# Altium schematic sheet MCU main.SchDoc: MCU
size A3; Date: 30 08 2013; Author: Rachid AKKOUCHE; CompanyName: RASoftware; DrawnBy: Rachid AKKOUCHE; Organization: RASoftware; Address1: 52 J03, rue de la crèche; Address2: 77100 MEAUX; Address3: FRANCE; DocumentNumber: BRA201308302C; Revision: C; SheetNumber: 2; SheetTotal: 11; Telephone: +33651604047; Email: rachid.akkouche@wanadoo.fr; Proprietaire: MDI System; Dessinepar: -; Verifiepar: -; Time: 19:00
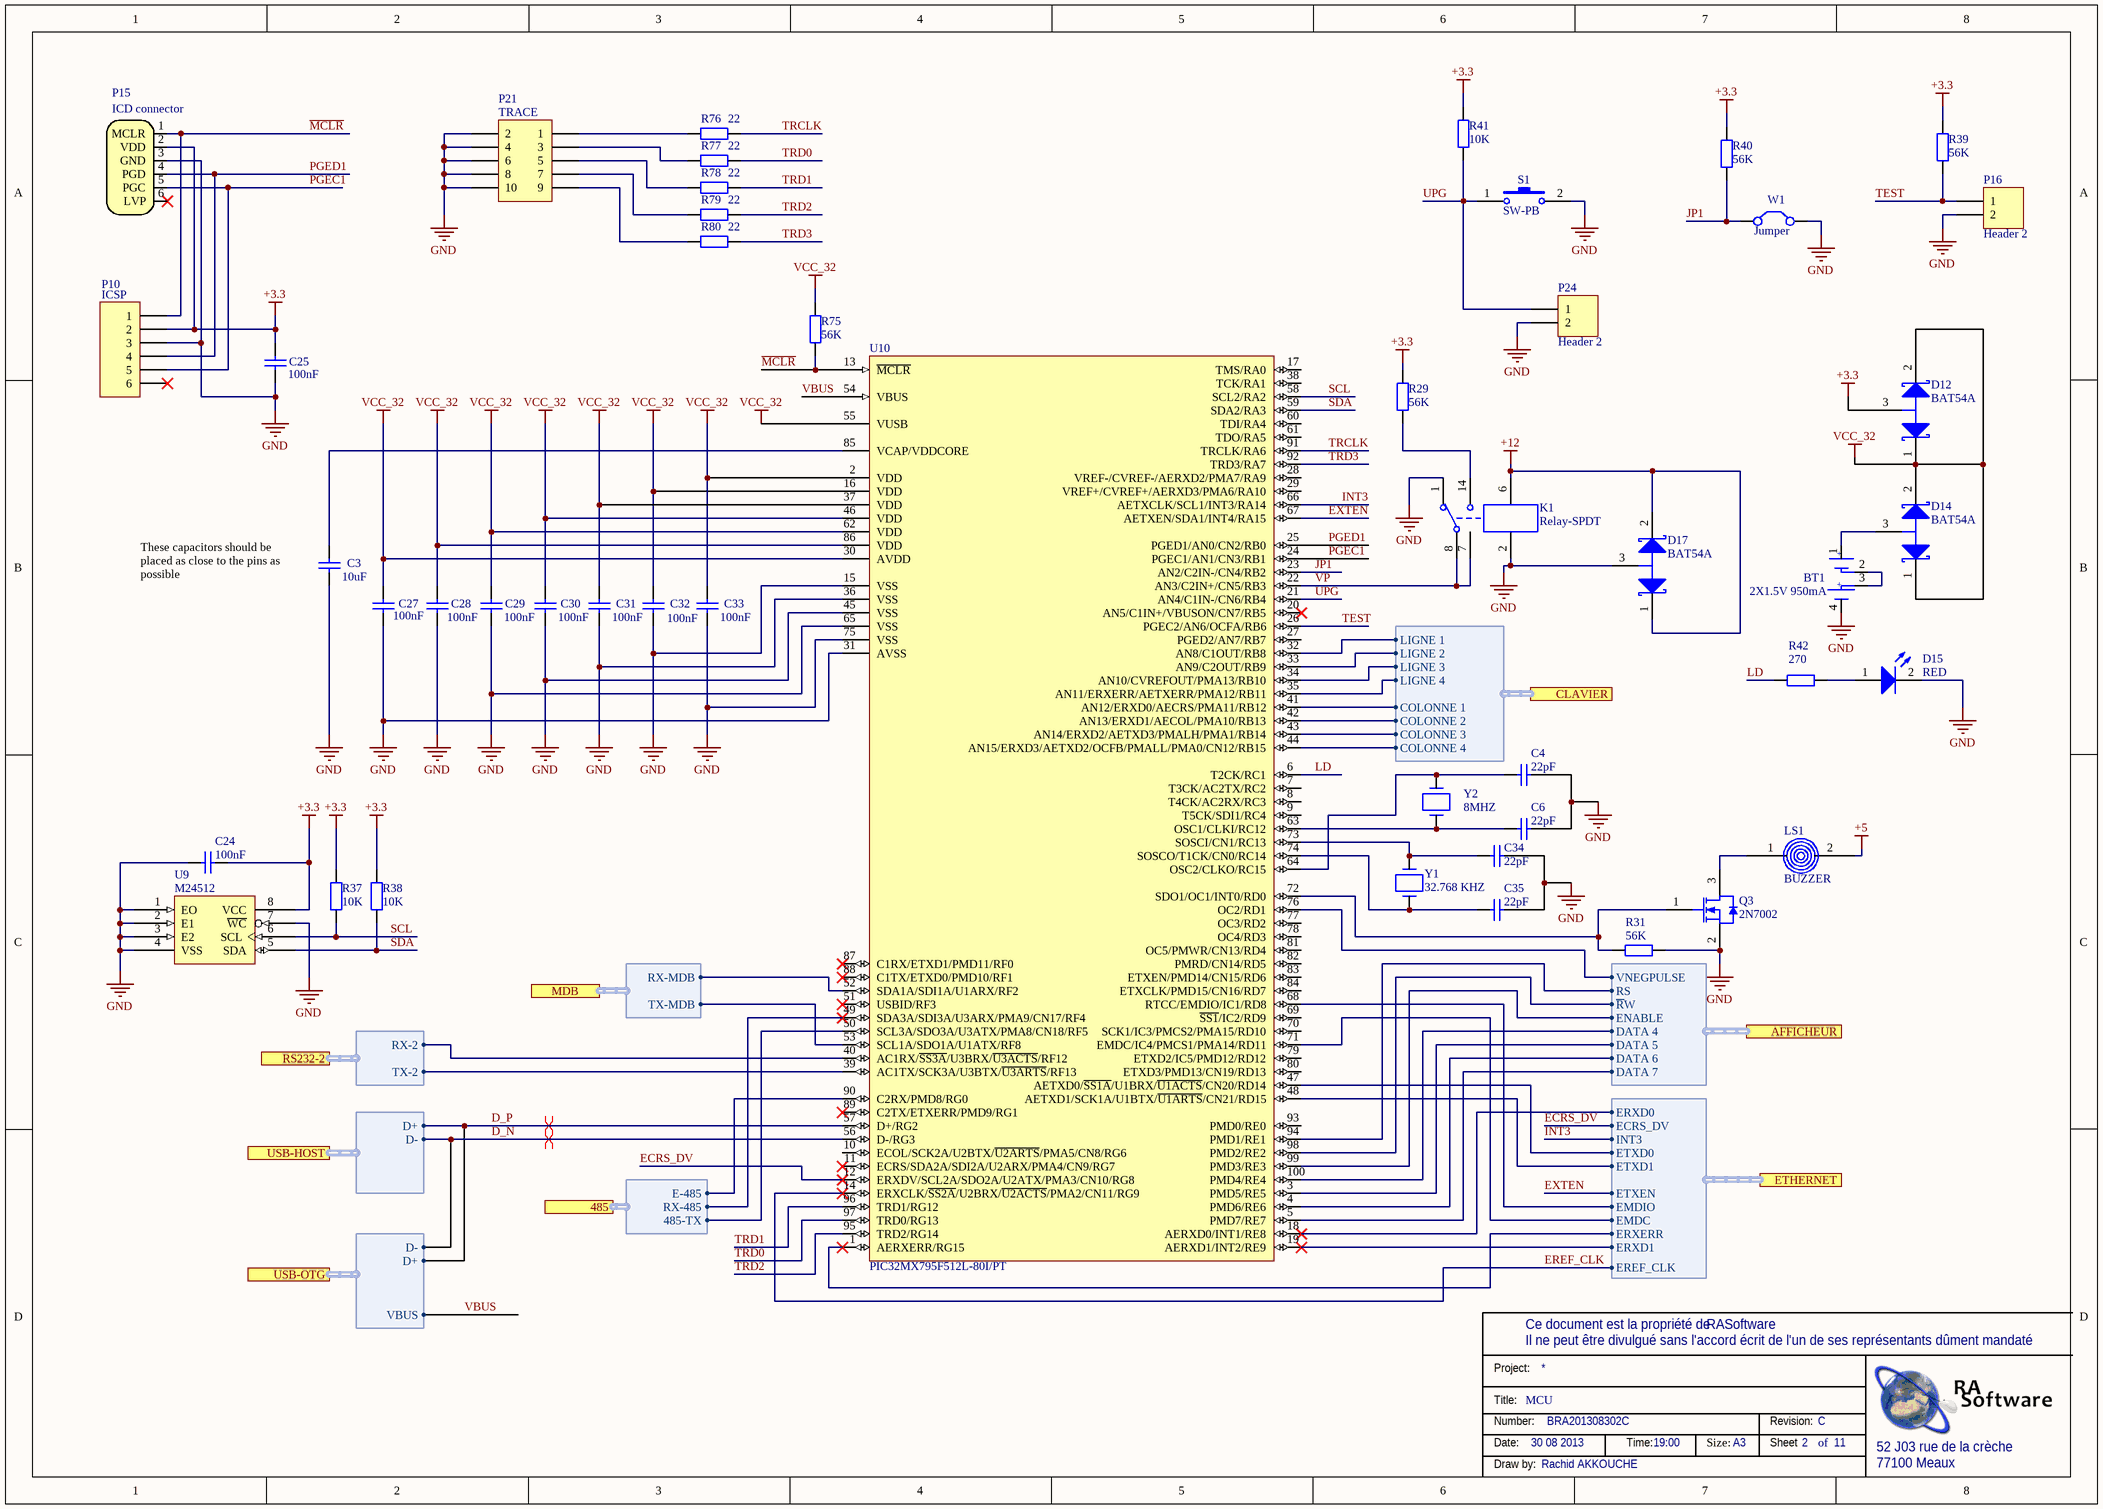
[diagram p0: MCU main.SchDoc]

## Parts
BT1  2X1.5V 950mA  [Support Pile 1023]
C3  10uF  [c0805]
C4  22pF  [C0805]
C6  22pF  [C0805]
C24  100nF  [C0805]
C25  100nF  [C0805]
C27  100nF  [C0805]
C28  100nF  [C0805]
C29  100nF  [C0805]
C30  100nF  [C0805]
C31  100nF  [C0805]
C32  100nF  [C0805]
C33  100nF  [C0805]
C34  22pF  [C0805]
C35  22pF  [C0805]
D12  BAT54A  [SOT23]
D14  BAT54A  [SOT23]
D15  Couleur: RED  [0603-LEDR]  (hidden comment: HSMH-C190)
D17  BAT54A  [SOT23]
K1  Relay-SPDT  [RELE-REED-PVX6012]
LS1  BUZZER
P10  M20-8770642  [M20_1X6]  (value not drawn)  (no BOM)
P15  ICD connector  [TC2030]  (no BOM)
P16  Header 2  [M20_1X2]
P21  M20-8760542  [HE10_10PTS_CMS]  (value not drawn)  (no BOM)
P24  Header 2  [M20_1X2]
Q3  2N7002  [SOT23]
R29  56K  [R0805]
R31  56K  [R0805]
R37  10K  [R0805]
R38  10K  [R0805]
R39  56K  [R0805]
R40  56K  [R0805]
R41  10K  [R0805]
R42  270  [R0805]
R75  56K  [R0805]
R76  22  [R0805]  (no BOM)
R77  22  [R0805]  (no BOM)
R78  22  [R0805]  (no BOM)
R79  22  [R0805]  (no BOM)
R80  22  [R0805]  (no BOM)
S1  SW-PB  [EVQQ2Y03W]
U9  M24512  [SOIC8]
U10  PIC32MX795F512L-80I/PT  [TQFP100pt]
W1  Jumper  [M20_1X2]
Y1  32.768 KHZ  [FSRLF]
Y2  8MHZ  [86SMX]

## Ports
485 (harness EIA-485), AFFICHEUR (harness IO DISPLAY), CLAVIER (harness KEYBOARD), ETHERNET (harness ETHERNET), MDB (harness MDB), RS232-2 (harness RS232_2), USB-HOST (harness USB-HOST), USB-OTG (harness USG-OTG)

## Harnesses
USB-HOST: D-, D+
USG-OTG: D-, D+, VBUS
RS232_2: TX-2, RX-2
ETHERNET: ETXEN, ETXD0, ETXD1, INT3, EMDIO, EMDC, ECRS_DV, ERXERR, ERXD0, ERXD1, EREF_CLK
IO DISPLAY: DATA 4, DATA 5, DATA 6, DATA 7, ENABLE, ~{R}W, RS, VNEGPULSE
KEYBOARD: COLONNE 1, COLONNE 2, COLONNE 3, COLONNE 4, LIGNE 1, LIGNE 2, LIGNE 3, LIGNE 4
EIA-485: 485-TX, RX-485, E-485
MDB: TX-MDB, RX-MDB

## Nets
+3.3: C24.1 C25.2 D12.3(A) P10.2 P15.2(VDD) R29.2 R37.2 R38.2 R39.2 R40.2 R41.2 U9.8(VCC)
+5: LS1.2(GND)
+12: D17.1(K1) D17.2(K2) K1.6
GND: BT1.4 C3.2 C4.1 C6.1 C24.2 C25.1 C27.1 C28.1 C29.1 C30.1 C31.1 C32.1 C33.1 C34.1 C35.1 D15.2(K) D17.3(A) K1.1 K1.2 P10.3 P15.3(GND) P16.2 P21.2 P21.4 P21.6 P21.8 P21.10 P24.2 Q3.2(S) R31.1 S1.2 U9.1(EO) U9.2(E1) U9.3(E2) U9.4(VSS) U9.7(~{WC}) U10.15(VSS) U10.31(AVSS) U10.36(VSS) U10.45(VSS) U10.65(VSS) U10.75(VSS) W1.2(C2)
VCC_32: C27.2 C28.2 C29.2 C30.2 C31.2 C32.2 C33.2 D12.1(K1) D12.2(K2) D14.1(K1) D14.2(K2) R75.2 U10.2(VDD) U10.16(VDD) U10.30(AVDD) U10.37(VDD) U10.46(VDD) U10.55(VUSB) U10.62(VDD) U10.86(VDD)
D_N: U10.56(D-/RG3) ; port USB-HOST.D-, port USB-OTG.D-
D_P: U10.57(D+/RG2) ; port USB-HOST.D+, port USB-OTG.D+
ECRS_DV: U10.12(ERXDV/SCL2A/SDO2A/U2ATX/PMA3/CN10/RG8) ; port ETHERNET.ECRS_DV
EREF_CLK: U10.14(ERXCLK/~{SS2A}/U2BRX/~{U2ACTS}/PMA2/CN11/RG9) ; port ETHERNET.EREF_CLK
EXTEN: U10.67(AETXEN/SDA1/INT4/RA15) ; port ETHERNET.ETXEN
INT3: U10.66(AETXCLK/SCL1/INT3/RA14) ; port ETHERNET.INT3
JP1: R40.1 U10.23(AN2/C2IN-/CN4/RB2) W1.1(C1)
LD: R42.2 U10.6(T2CK/RC1)
~{MCLR}: P10.1 P15.1(MCLR) R75.1 U10.13(~{MCLR})
PGEC1: P10.5 P15.5(PGC) U10.24(PGEC1/AN1/CN3/RB1)
PGED1: P10.4 P15.4(PGD) U10.25(PGED1/AN0/CN2/RB0)
SCL: R37.1 U9.6(SCL) U10.58(SCL2/RA2)
SDA: R38.1 U9.5(SDA) U10.59(SDA2/RA3)
TEST: P16.1 R39.1 U10.26(PGEC2/AN6/OCFA/RB6)
TRCLK: R76.1 U10.91(TRCLK/RA6)
TRD0: R77.1 U10.97(TRD0/RG13)
TRD1: R78.1 U10.96(TRD1/RG12)
TRD2: R79.1 U10.95(TRD2/RG14)
TRD3: R80.1 U10.92(TRD3/RA7)
UPG: P24.1 R41.1 S1.1 U10.21(AN4/C1IN-/CN6/RB4)
VBUS: U10.54(VBUS) ; port USB-OTG.VBUS
VP: K1.7 K1.8 U10.22(AN3/C2IN+/CN5/RB3)
NetBT1_1: BT1.1(+) D14.3(A)
NetBT1_2: BT1.2 BT1.3
NetC3_1: C3.1 U10.85(VCAP/VDDCORE)
NetC4_2: C4.2 U10.64(OSC2/CLKO/RC15) Y2.2
NetC6_2: C6.2 U10.63(OSC1/CLKI/RC12) Y2.1
NetC34_2: C34.2 U10.73(SOSCI/CN1/RC13) Y1.1
NetC35_2: C35.2 U10.74(SOSCO/T1CK/CN0/RC14) Y1.2
NetD15_1: D15.1(A) R42.1
NetK1_14: K1.14 R29.1
NetLS1_1: LS1.1(+) Q3.3(D)
NetP21_1: P21.1 R76.2
NetP21_3: P21.3 R77.2
NetP21_5: P21.5 R78.2
NetP21_7: P21.7 R79.2
NetP21_9: P21.9 R80.2
NetQ3_1: Q3.1(G) R31.2 U10.72(SDO1/OC1/INT0/RD0)
NetU10_1: U10.1(AERXERR/RG15) ; port ETHERNET.ERXERR
NetU10_3: U10.3(PMD5/RE5) ; port AFFICHEUR.DATA 5
NetU10_4: U10.4(PMD6/RE6) ; port AFFICHEUR.DATA 6
NetU10_5: U10.5(PMD7/RE7) ; port AFFICHEUR.DATA 7
NetU10_18: U10.18(AERXD0/INT1/RE8) ; port ETHERNET.ERXD0
NetU10_19: U10.19(AERXD1/INT2/RE9) ; port ETHERNET.ERXD1
NetU10_32: U10.32(AN8/C1OUT/RB8) ; port CLAVIER.LIGNE 1
NetU10_33: U10.33(AN9/C2OUT/RB9) ; port CLAVIER.LIGNE 2
NetU10_34: U10.34(AN10/CVREFOUT/PMA13/RB10) ; port CLAVIER.LIGNE 3
NetU10_35: U10.35(AN11/ERXERR/AETXERR/PMA12/RB11) ; port CLAVIER.LIGNE 4
NetU10_39: U10.39(AC1TX/SCK3A/U3BTX/~{U3ARTS}/RF13) ; port RS232-2.TX-2
NetU10_40: U10.40(AC1RX/~{SS3A}/U3BRX/~{U3ACTS}/RF12) ; port RS232-2.RX-2
NetU10_41: U10.41(AN12/ERXD0/AECRS/PMA11/RB12) ; port CLAVIER.COLONNE 1
NetU10_42: U10.42(AN13/ERXD1/AECOL/PMA10/RB13) ; port CLAVIER.COLONNE 2
NetU10_43: U10.43(AN14/ERXD2/AETXD3/PMALH/PMA1/RB14) ; port CLAVIER.COLONNE 3
NetU10_44: U10.44(AN15/ERXD3/AETXD2/OCFB/PMALL/PMA0/CN12/RB15) ; port CLAVIER.COLONNE 4
NetU10_47: U10.47(AETXD0/~{SS1A}/U1BRX/~{U1ACTS}/CN20/RD14) ; port ETHERNET.ETXD0
NetU10_48: U10.48(AETXD1/SCK1A/U1BTX/~{U1ARTS}/CN21/RD15) ; port ETHERNET.ETXD1
NetU10_49: U10.49(SDA3A/SDI3A/U3ARX/PMA9/CN17/RF4) ; port 485.RX-485
NetU10_50: U10.50(SCL3A/SDO3A/U3ATX/PMA8/CN18/RF5) ; port 485.485-TX
NetU10_52: U10.52(SDA1A/SDI1A/U1ARX/RF2) ; port MDB.RX-MDB
NetU10_53: U10.53(SCL1A/SDO1A/U1ATX/RF8) ; port MDB.TX-MDB
NetU10_68: U10.68(RTCC/EMDIO/IC1/RD8) ; port ETHERNET.EMDIO
NetU10_71: U10.71(EMDC/IC4/PMCS1/PMA14/RD11) ; port ETHERNET.EMDC
NetU10_76: U10.76(OC2/RD1) ; port AFFICHEUR.VNEGPULSE
NetU10_90: U10.90(C2RX/PMD8/RG0) ; port 485.E-485
NetU10_94: U10.94(PMD1/RE1) ; port AFFICHEUR.RS
NetU10_98: U10.98(PMD2/RE2) ; port AFFICHEUR.~{R}W
NetU10_99: U10.99(PMD3/RE3) ; port AFFICHEUR.ENABLE
NetU10_100: U10.100(PMD4/RE4) ; port AFFICHEUR.DATA 4

Not connected (* = marked no-connect by the designer): P10 6*; P15 6(LVP)*; U10 7(T3CK/AC2TX/RC2) 8(T4CK/AC2RX/RC3) 9(T5CK/SDI1/RC4) 10(ECOL/SCK2A/U2BTX/~{U2ARTS}/PMA5/CN8/RG6) 11(ECRS/SDA2A/SDI2A/U2ARX/PMA4/CN9/RG7)* 17(TMS/RA0) 20(AN5/C1IN+/VBUSON/CN7/RB5)* 27(PGED2/AN7/RB7) 28(VREF-/CVREF-/AERXD2/PMA7/RA9) 29(VREF+/CVREF+/AERXD3/PMA6/RA10) 38(TCK/RA1) 51(USBID/RF3)* 60(TDI/RA4) 61(TDO/RA5) 69(~{SS1}/IC2/RD9) 70(SCK1/IC3/PMCS2/PMA15/RD10) 77(OC3/RD2) 78(OC4/RD3) 79(ETXD2/IC5/PMD12/RD12) 80(ETXD3/PMD13/CN19/RD13) 81(OC5/PMWR/CN13/RD4) 82(PMRD/CN14/RD5) 83(ETXEN/PMD14/CN15/RD6) 84(ETXCLK/PMD15/CN16/RD7) 87(C1RX/ETXD1/PMD11/RF0)* 88(C1TX/ETXD0/PMD10/RF1)* 89(C2TX/ETXERR/PMD9/RG1)* 93(PMD0/RE0)

## Layout directives
differential pair: D_N, D_P

## Notes on the sheet
- (near C3) These capacitors should be placed as close to the pins as possible
- Ce document est la propriété de
- Project:
- Il ne peut être divulgué sans l'accord écrit de l'un de ses représentants dûment mandaté
- Title:
- Number:
- Date:
- Time:
- Size:
- A3
- Revision:
- Sheet
- of
- 52 J03 rue de la crèche
- Draw by:
- 77100 Meaux
- (in symbol Header 5X2) TRACE
- (in symbol Header 6) ICSP

## Library data of the parts
BT1 = BATTERYX2
C3 = Cap 0805 1uF: Capacitor; Manufacturer: YAGEO; Manufacturer Part Number: CC0805KKX5R5BB106; Unit: pcs; SuppliedAmount: 3000; MinAmount: 100; Capacitor type: ceramic; Capacitor kind: MLCC; Capacitance: 10µF; Operating voltage: 6.3V; Dielectric: X5R; Tolerance: ±10%; Supplier 1: TME; Supplier Part Number 1: CC0805KKX5R5106; Category: 0805 MLCC SMD Capacitors; Stock 1: 19000; Weight: 0,034; Multiples: 100; Mounting: SMD; Case: 0805; ComponentLink1URL: http://www.tme.eu/en/details/cc0805kkx5r5106/0805-mlcc-smd-capacitors/yageo/cc0805kkx5r5bb106/; ComponentLink1Description: http://www.tme.eu/en/details/cc0805kkx5r5106/0805-mlcc-smd-capacitors/yageo/cc0805kkx5r5bb106/
C4 C6 C34 C35 = Cap 0805 22pF: Capacitor; Manufacturer: YAGEO; Manufacturer Part Number: CC0805JRNPO9BN220; Supplier 1: Farnell; Supplier Part Number 1: 1816807; RoHS: YES; Pricing 1: 1=0,019, 25=0,016, 50=0,014, 100=0,011, 200=0,009, 1000=0,008 (EUR); ComponentLink1URL: http://www.farnell.com/datasheets/1132289.pdf; ComponentLink1Description: http://www.farnell.com/datasheets/1132289.pdf; Stock 1: 154
C24 C25 C27-C33 = Cap 0805 100nF: Capacitor; Manufacturer: MULTICOMP; Manufacturer Part Number: MCCA000296; Supplier 1: Farnell; Supplier Part Number 1: 1759167; Pricing 1: 100=0,01, 500=0,008, 1000=0,006, 4000=0,005 (EUR); ComponentLink1URL: http://www.farnell.com/datasheets/1520827.pdf; ComponentLink1Description: http://www.farnell.com/datasheets/1520827.pdf
D12 D14 D17 = BAT54A: Schottky Barrier Double Diode; Manufacturer: FAIRCHILD SEMICONDUCTOR; Courant, If moy.: 200; Tension, Vrrm: 30; Tension, Vf max..: 320; Temps trr max.: 5; Courant, Ifs max.: 600; Température d'utilisation min: -55; Température de fonctionnement max..: 150; Type de boîtier diode: SOT-23; Nombre de broches: 3; SVHC: No SVHC (20-Jun-2013); Configuration diode: Double anode commune; Courant, If, Vf: 1; Marquage, CMS: L42; Température de fonctionnement: -55°C à +150; Type de terminaison: SMD; Supplier 1: Farnell; Supplier Part Number 1: 1228222; Manufacturer Part Number: BAT54A; RoHS: YES; Pricing 1: 5=0,084, 25=0,082, 100=0,036, 1000=0,032, 3000=0,03 (EUR); Diode Type: Schottky; MSL: MSL 1 - Illimité; Température, Tj max..: 150; Type de boîtier: SOT-23; courant Ifsm: 600; ComponentLink1URL: http://www.farnell.com/datasheets/1718084.pdf; ComponentLink1Description: http://www.farnell.com/datasheets/1718084.pdf; ComponentLink2URL: http://www.farnell.com/datasheets/410597.pdf; ComponentLink2Description: http://www.farnell.com/datasheets/410597.pdf
D15 = HSMH-C190: Surface Mount Chip LED, Red; Manufacturer: AVAGO TECHNOLOGIES; Manufacturer Part Number: HSMH-C190.; Taille de lampe: 0.8mm x 1; Couleur de LED: Rouge; Intensité lumineuse: 17; Angle, vision: 170°; Courant, direct, If: 20; Tension, direct à  If: 1.8; Montage LED: CMS; Forme de lentille: Rectangulaire; Longueur d'onde typ.: 626; SVHC: No SVHC (19-Dec-2012); Dissipation de puissance: 65; Intensité lumineuse min. à  If: 2.8; Intensité lumineuse typique: 10; Largeur (externe): 0.8; Longueur d'onde dominante: 639; Longueur d'onde, crête: 630; Longueur/hauteur: 1.6; Matière: AlGaAs; Nombre de broches: 2; Orientation de montage opto: Dessus; Orientation sortie de lumière: Top Emitting; Température de fonctionnement: -30°C à +85; Température de fonctionnement max..: 85; Température, stockage min.: -40; Température d'utilisation min: -30; Tension, Vf max..: 2.6; Tension, Vf min.: 2.1; Type de LED: Standard; Supplier 1: Farnell; Supplier Part Number 1: 8554641; RoHS: YES; Stock 1: 13902; Pricing 1: 5=0,06, 25=0,059, 100=0,057, 250=0,052, 500=0,047 (EUR); MSL: MSL 2A - 4 semaines; Couleur, LED: Rouge; Profondeur: 0.8; Température, stockage max..: 85; Tension, Vf typ.: 1.8; ComponentLink1URL: http://www.farnell.com/datasheets/313031.pdf; ComponentLink1Description: http://www.farnell.com/datasheets/313031.pdf; ComponentLink2URL: http://www.farnell.com/datasheets/55927.pdf; ComponentLink2Description: http://www.farnell.com/datasheets/55927.pdf
K1 = Relay-SPDT: Single-Pole Dual-Throw Relay; Manufacturer: STANDEXMEDER; Manufacturer Part Number: DIP12-1C90-51L; Published: 24-Mar-1999; LatestRevisionDate: 17-Jul-2002; LatestRevisionNote: Re-released for DXP Platform.; PackageReference: MODULE5B; Publisher: Altium Limited; Supplier 1: Farnell; Supplier Part Number 1: 1079450; RoHS: YES; Stock 1: 98; Pricing 1: 1=7,78, 10=6,03, 25=5,83, 50=5,7, 90=5,12, 300=4,53, 900=4,07, 2000=3,67 (EUR); ComponentLink1URL: http://www.farnell.com/datasheets/91165.pdf; ComponentLink1Description: http://www.farnell.com/datasheets/91165.pdf
LS1 = ABI-017-RC: SMD magnetic transducter buzzer; Manufacturer: Pro Signal; Self Resonant Frequency: 2.4kHz; Min Supply Voltage (DC): 4V; Max Supply Voltage (DC): 7V; Supplier 1: Farnell; Manufacturer Part Number: ABI-017-RC; Stock 1: 13787; Pricing 1: 1=2.5, 10=2.21, 50=2.18, 100=2.16, 200=2.12, 500=2.07, 2500=2.03 (EUR); Case/Package: SMD/SMT; Height: 12.8mm; REACH SVHC: No SVHC; ComponentLink1URL: https://datasheet.ciiva.com/1323/1671249-1323219.pdf; ComponentLink1Description: https://datasheet.ciiva.com/1323/1671249-1323219.pdf; ComponentLink2URL: https://datasheet.ciiva.com/1743/97464-1743575.pdf; ComponentLink2Description: https://datasheet.ciiva.com/1743/97464-1743575.pdf; Supplier Part Number 1: 1504107
P10 = Header 6: Header, 6-Pin; Manufacturer: HARWIN; Type de connecteur: Contact fil-à-carte; Série: M20; Terminaison du contact: Montage en surface vertical; Genre: Embase; Nombre de contacts: 6; Nombre de rangées: 1; Pas: 2.54; Plaquage du contact: Or; Matériau du contact: Laiton; SVHC: No SVHC (19-Dec-2012); Supplier 1: Farnell; Supplier Part Number 1: 1517384; Manufacturer Part Number: M20-8770642; RoHS: YES; Stock 1: 3471; Pricing 1: 10=0,69, 20=0,66, 50=0,62, 100=0,6, 250=0,56, 500=0,49 (EUR); Pas, rang: 2.54; ComponentLink1URL: http://www.farnell.com/datasheets/1089524.pdf; ComponentLink1Description: http://www.farnell.com/datasheets/1089524.pdf; ComponentLink2URL: http://www.farnell.com/datasheets/5481.pdf; ComponentLink2Description: http://www.farnell.com/datasheets/5481.pdf
P15 = TC2030-MCP-NL: Conector par ICD
P16 P24 = Header 2: Header, 2-Pin; Manufacturer: HARWIN; Manufacturer Part Number: M20-8770242; Product Range: HARWIN - M20-87 Series; Terminaison du contact: PCB; Genre: Connecteur mâle; Nombre de contacts: 2; Nombre de rangées: 1; Pas: 2.54; Plaquage du contact: Or; Matériau du contact: Laiton; SVHC: No SVHC (20-Jun-2013); LatestRevisionDate: 17-Jul-2002; LatestRevisionNote: Re-released for DXP Platform.; Publisher: Altium Limited; Supplier 1: Farnell; Supplier Part Number 1: 1895211; RoHS: YES; Pricing 1: 10=0,137, 20=0,136, 50=0,135, 100=0,133, 250=0,128, 500=0,12 (EUR); ComponentLink1URL: http://www.farnell.com/cad/1330190.pdf; ComponentLink1Description: http://www.farnell.com/cad/1330190.pdf
P21 = Header 5X2: Header, 5-Pin, Dual row; Manufacturer: HARWIN; Type de connecteur: Contact fil-à-carte; Série: M20; Terminaison du contact: Montage en surface vertical; Genre: Embase; Nombre de contacts: 10; Nombre de rangées: 2; Pas: 2.54; Plaquage du contact: Or; Matériau du contact: Laiton; SVHC: No SVHC (19-Dec-2012); Supplier 1: Farnell; Supplier Part Number 1: 1517390; Manufacturer Part Number: M20-8760542; RoHS: YES; Stock 1: 4126; Pricing 1: 10=0,89, 20=0,75, 50=0,66, 100=0,55, 250=0,54, 500=0,53 (EUR); Pas, rang: 2.54; ComponentLink1URL: http://www.farnell.com/datasheets/1089515.pdf; ComponentLink1Description: http://www.farnell.com/datasheets/1089515.pdf; ComponentLink2URL: http://www.farnell.com/datasheets/5481.pdf; ComponentLink2Description: http://www.farnell.com/datasheets/5481.pdf
Q3 = 2N7002: N-channel Enhancement Mode Field-effect Transistor; Manufacturer: STMICROELECTRONICS; Published: 17-Sep-2003; LatestRevisionDate: 12-Dec-2006; LatestRevisionNote: IPC-7351 Footprint Added.; DatasheetVersion: 27-Jul-2000; PackageVersion: May-1999; PackageReference: SOT23; Publisher: Altium Limited; PackageDescription: 3-Pin SOT-23 Package 0.95 mm Pitch, 2.3 mm Lead Span; ComponentLink1Description: Manufacturer Link; ComponentLink1URL: http://www.semiconductors.philips.com/; ComponentLink2Description: Datasheet; ComponentLink2URL: http://www.semiconductors.philips.com/acrobat/datasheets/2N7002_4.pdf; Supplier 1: Farnell; Supplier Part Number 1: 9512608; Manufacturer Part Number: 2N7002; RoHS: YES; Pricing 1: 1=0,56, 25=0,48, 100=0,44, 250=0,43, 1000=0,42 (EUR); ComponentLink3URL: http://www.st.com/web/en/resource/technical/document/datasheet/CD00005134.pdf; ComponentLink3Description: http://www.st.com/web/en/resource/technical/document/datasheet/CD00005134.pdf
R29 R31 R39 R40 R75 = Resistor 0805 56K: Resistor; Manufacturer: MULTICOMP; Manufacturer Part Number: MC0.1W08051%56KFR; Product Range: MULTICOMP - MC Series; Résistance: 56; Puissance: 100; Tolérance de résistance: ± 1%; Type de boîtier de résistance: 0805; Type de résistance: Couche épaisse; Coefficient de température: ± 100; Tension: 150; Type de packaging: Full Reel; Resistor Mounting: CMS; Resistor Terminals: (Non Disponible); Supplier 1: Farnell; RoHS: YES; Pricing 1: 5000=0,001 (EUR); MSL: (Non Applicable); ComponentLink1URL: http://www.farnell.com/datasheets/1716700.pdf; ComponentLink1Description: http://www.farnell.com/datasheets/1716700.pdf; Supplier Part Number 1: 2129258
R37 R38 R41 = Resistor 0805 10K: Resistor; Manufacturer: MULTICOMP; Manufacturer Part Number: MC0.1W08051%10KFR; Product Range: MULTICOMP - MC Series; Résistance: 10; Puissance: 100; Tolérance de résistance: ± 1%; Type de boîtier de résistance: 0805; Type de résistance: Couche épaisse; Coefficient de température: ± 100; Tension: 150; Type de packaging: Full Reel; Resistor Mounting: CMS; Supplier 1: Farnell; RoHS: YES; Pricing 1: 5000=0,001 (EUR); MSL: MSL 1 - Illimité; ComponentLink1URL: http://www.farnell.com/datasheets/1716700.pdf; ComponentLink1Description: http://www.farnell.com/datasheets/1716700.pdf; Supplier Part Number 1: 2129195
R42 = Resistor 0805 1K: Resistor; Manufacturer: MULTICOMP; Manufacturer Part Number: MC0.1W08051%1KFR; Product Range: MULTICOMP - MC Series; Résistance: 1; Puissance: 100; Tolérance de résistance: ± 1%; Type de boîtier de résistance: 0805; Type de résistance: Couche épaisse; Coefficient de température: ± 100; Tension: 150; Type de packaging: Full Reel; Resistor Mounting: CMS; Supplier 1: Farnell; RoHS: YES; Pricing 1: 5000=0,001 (EUR); MSL: MSL 1 - Illimité; ComponentLink1URL: http://www.farnell.com/datasheets/1716700.pdf; ComponentLink1Description: http://www.farnell.com/datasheets/1716700.pdf; Supplier Part Number 1: 2129113
R76-R80 = Resistor 0805 22: Resistor; Manufacturer: MULTICOMP; Manufacturer Part Number: MC01W0805122R; Product Range: MULTICOMP - MC Series; Puissance: 100; Tolérance de résistance: ± 1%; Type de boîtier de résistance: 0805; Type de résistance: Couche épaisse; Coefficient de température: ± 200; Tension: 150; Type de packaging: Full Reel; SVHC: No SVHC (20-Jun-2013); Resistor Mounting: CMS; Supplier 1: Farnell; RoHS: YES; Pricing 1: 5000=0,001 (EUR); Résistance: 22; MSL: -; ComponentLink1URL: http://www.farnell.com/datasheets/1729047.pdf; ComponentLink1Description: http://www.farnell.com/datasheets/1729047.pdf; Supplier Part Number 1: 2128982
S1 = SW-PB: Switch; Manufacturer: PANASONIC; Published: 24-Mar-1999; LatestRevisionDate: 17-Jul-2002; LatestRevisionNote: Re-released for DXP Platform.; PackageReference: SPST-2; Publisher: Altium Limited; PackageDescription: Switch; 2 Leads; Supplier 1: Farnell; Supplier Part Number 1: 9962875; Manufacturer Part Number: EVQQ2Y03W; RoHS: YES; Pricing 1: 1=0,34, 50=0,27, 100=0,23 (EUR); ComponentLink1URL: http://www.farnell.com/datasheets/28111.pdf; ComponentLink1Description: http://www.farnell.com/datasheets/28111.pdf
U9 = M24512-MN: EEPROM 512K I2C; Manufacturer: STMICROELECTRONICS; Manufacturer Part Number: M24512-WMN6P; Supplier 1: Farnell; RoHS: YES; Pricing 1: 1=1,2, 10=1,08, 100=0,96 (EUR); ComponentLink1URL: http://www.st.com/st-web-ui/static/active/en/resource/technical/document/datasheet/CD00251873.pdf; ComponentLink1Description: http://www.st.com/st-web-ui/static/active/en/resource/technical/document/datasheet/CD00251873.pdf; ComponentLink2URL: http://www.farnell.com/cad/1550662.zip; ComponentLink2Description: http://www.farnell.com/cad/1550662.zip; Supplier Part Number 1: 1670818
U10 = PIC32MX795F512L-80I/PT: High Performance 80 MHz MIPS-Based 32-Bit Flash Microcontroller with USB, CAN and Ethernet, 512KB Program Memory, 100-pin TQFP, Industrial Temperature; Published: 2-Dec-2009; DatasheetVersion: revB, Nov-2009; PackageVersion: revBB, Aug-2009; PackageReference: TQFP-PT100; Publisher: Altium Limited; PackageDescription: 100-Lead Plastic Thin Quad Flatpack (PT) - 12x12x1mm Body, 2.00mm [TQFP]; Supplier 1: Digi-Key; Supplier Part Number 1: 1778492; Supplier 2: Farnell; Supplier Part Number 2: 1778492; ComponentLink1Description: Datasheet; ComponentLink1URL: http://ww1.microchip.com/downloads/en/DeviceDoc/DS-61156B.pdf; ComponentLink2Description: Packaging Specification; ComponentLink2URL: http://ww1.microchip.com/downloads/en/PackagingSpec/en012702.pdf; ComponentLink3Description: Microchip.com Home; ComponentLink3URL: http://www.microchip.com/
W1 = Jumper: Jumper Wire; Manufacturer: HARWIN; Manufacturer Part Number: M20-8770242; Product Range: HARWIN - M20-87 Series; Terminaison du contact: PCB; Genre: Connecteur mâle; Nombre de contacts: 2; Nombre de rangées: 1; Pas: 2.54; Plaquage du contact: Or; Matériau du contact: Laiton; SVHC: No SVHC (20-Jun-2013); Published: 24-Mar-1999; LatestRevisionDate: 17-Jul-2002; LatestRevisionNote: Re-released for DXP Platform.; PackageReference: RAD-0.2; Publisher: Altium Limited; PackageDescription: Radial Cap, Thru-Hole; 2 Leads; 0.2 in Pin Spacing; Supplier 1: Farnell; Supplier Part Number 1: 1895211; RoHS: YES; Pricing 1: 10=0,137, 20=0,136, 50=0,135, 100=0,133, 250=0,128, 500=0,12 (EUR); ComponentLink1URL: http://www.farnell.com/cad/1330190.pdf; ComponentLink1Description: http://www.farnell.com/cad/1330190.pdf
Y1 = CRYSTAL2: Manufacturer: FOX ELECTRONICS; Manufacturer Part Number: FSRLF327.; Frequency: 32.768; Frequency Tolerance: ± 20; Load Capacitance: 12.5; Crystal Mounting Type: SMD; No. of Pins: 2; Supplier 1: Farnell; Supplier Part Number 1: 2058067; RoHS: YES; Pricing 1: 1=0,95, 6000=0,76, 9000=0,66, 30000=0,59, 51000=0,56 (EUR); Operating Temperature Min: -40; Operating Temperature Max: 85; ComponentLink1URL: http://www.foxonline.com/pdfs/fsrlf.pdf; ComponentLink1Description: http://www.foxonline.com/pdfs/fsrlf.pdf
Y2 = CRYSTAL2: Manufacturer: FOX ELECTRONICS; Manufacturer Part Number: FPXLF080-20; Supplier 1: Farnell; Supplier Part Number 1: 2064009; RoHS: YES; Pricing 1: 1=1,92, 10=1,25, 100=0,95, 250=0,89, 500=0,79, 3000=0,491, 3000=0,442, 20000=0,427 (EUR); ComponentLink1URL: http://www.foxonline.com/pdfs/fpxlf.pdf; ComponentLink1Description: http://www.foxonline.com/pdfs/fpxlf.pdf